# Altium schematic sheet SH16 - SPI ROM.SchDoc
size 386 x 246 mm
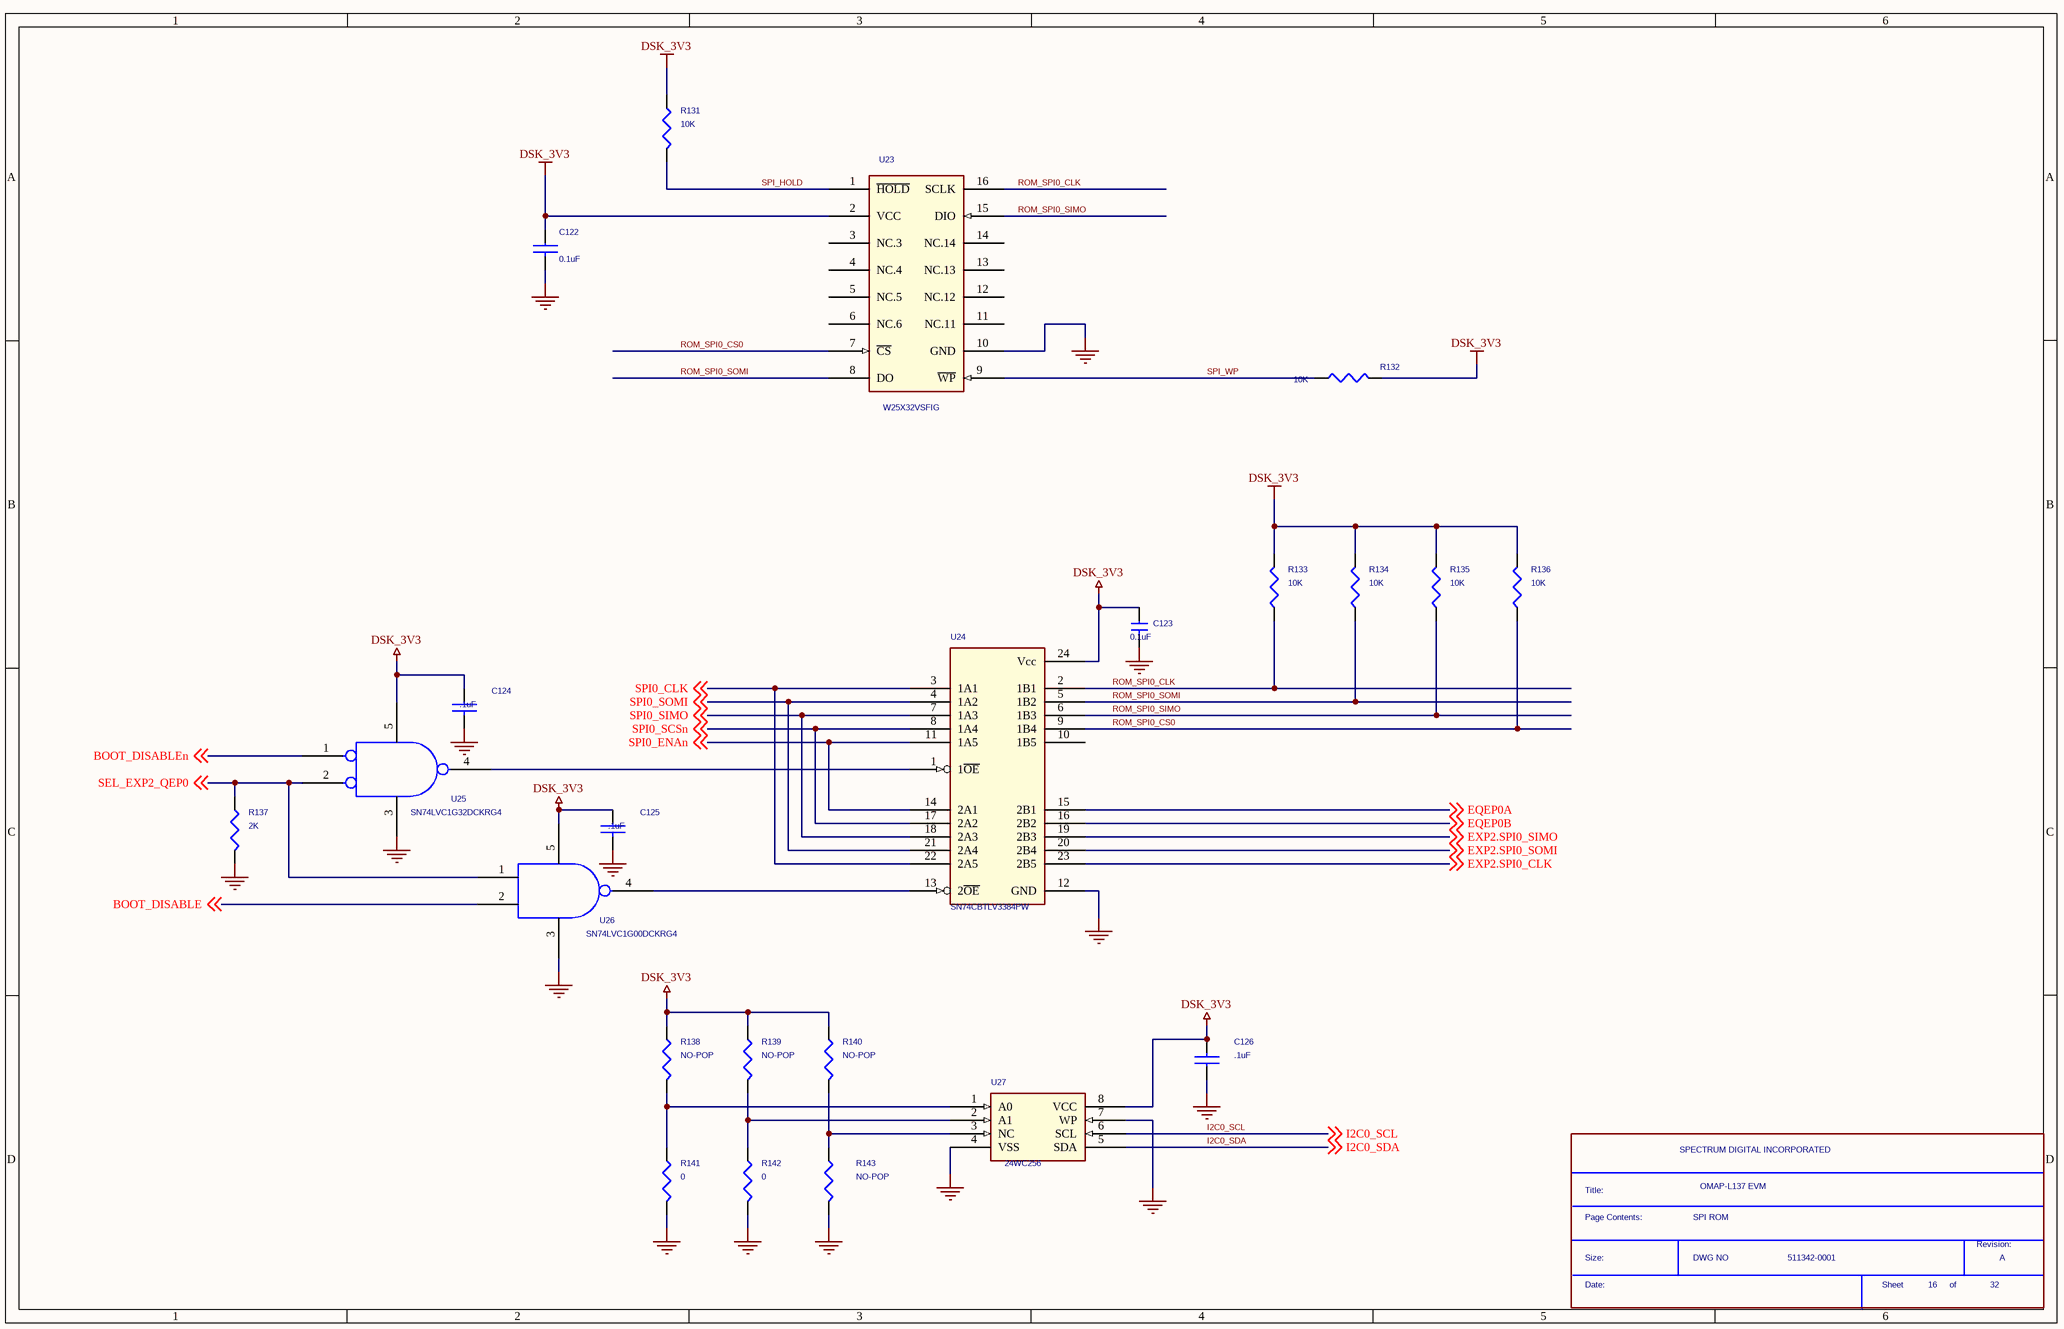
[diagram p0: SH16 - SPI ROM.SchDoc]

## Parts
*  Page Contents:: SPI ROM  RevCode: A  Title: OMAP-L137 EVM  OrgName: SPECTRUM DIGITAL INCORPORATED  Doc: 511342-0001  Page Number: 16  Page Count: 32  (hidden comment: SDTitleBlock)  (graphical)
C122  0.1uF  [c402-25]
C123  0.1uF  [c402-25]
C124  .1uF  [c402-25]
C125  .1uF  [c402-25]
C126  .1uF  [C0603]
R131  10K  [r402-25]
R132  10K  [r402-25]
R133  10K  [r402-25]
R134  10K  [r402-25]
R135  10K  [r402-25]
R136  10K  [r402-25]
R137  2K  [r402-25]
R138  NO-POP  [r402-25]
R139  NO-POP  [r402-25]
R140  NO-POP  [r402-25]
R141  0  [r402-25]
R142  0  [r402-25]
R143  NO-POP  [r402-25]
U23  W25X32VSFIG  [so16-25x75-300]
U24  SN74CBTLV3384PW  [TSSOP-24]
U25  SN74LVC1G32DCKRG4  [dck-5]
U26  SN74LVC1G00DCKRG4  [dck-5]
U27  24WC256  [SOIC]

## Nets
DSK_3V3: C122.1 C123.1 C124.1 C125.1 C126.2 R131.1 R132.1 R133.2 R134.2 R135.2 R136.2 R138.1 R139.1 R140.1 U23.2(VCC) U24.24(Vcc) U25.5(VCC) U26.5(VCC) U27.8(VCC)
GND: C122.2 C123.2 C124.2 C125.2 C126.1 R137.2 R141.2 R142.2 R143.2 U23.10(GND) U24.12(GND) U25.3(GND) U26.3(GND) U27.4(VSS) U27.7(WP)
BOOT_DISABLE: U26.2(B) ; off-sheet BOOT_DISABLE
BOOT_DISABLEn: U25.1(A) ; off-sheet BOOT_DISABLEn
EQEP0A: U24.15(2B1) ; off-sheet EQEP0A
EQEP0B: U24.16(2B2) ; off-sheet EQEP0B
EXP2.SPI0_CLK: U24.23(2B5) ; off-sheet EXP2.SPI0_CLK
EXP2.SPI0_SIMO: U24.19(2B3) ; off-sheet EXP2.SPI0_SIMO
EXP2.SPI0_SOMI: U24.20(2B4) ; off-sheet EXP2.SPI0_SOMI
I2C0_SCL: U27.6(SCL) ; off-sheet I2C0_SCL
I2C0_SDA: U27.5(SDA) ; off-sheet I2C0_SDA
ROM_SPI0_CLK: R133.1 U23.16(SCLK) U24.2(1B1)
ROM_SPI0_CS0: R136.1 U23.7(~{CS}) U24.9(1B4)
ROM_SPI0_SIMO: R135.1 U23.15(DIO) U24.6(1B3)
ROM_SPI0_SOMI: R134.1 U23.8(DO) U24.5(1B2)
SEL_EXP2_QEP0: R137.1 U25.2(B) U26.1(A) ; off-sheet SEL_EXP2_QEP0
SPI0_CLK: U24.3(1A1) U24.22(2A5) ; off-sheet SPI0_CLK
SPI0_ENAn: U24.11(1A5) U24.14(2A1) ; off-sheet SPI0_ENAn
SPI0_SCSn: U24.8(1A4) U24.17(2A2) ; off-sheet SPI0_SCSn
SPI0_SIMO: U24.7(1A3) U24.18(2A3) ; off-sheet SPI0_SIMO
SPI0_SOMI: U24.4(1A2) U24.21(2A4) ; off-sheet SPI0_SOMI
SPI_HOLD: R131.2 U23.1(~{HOLD})
SPI_WP: R132.2 U23.9(~{WP})
NetR138_2: R138.2 R141.1 U27.1(A0)
NetR139_2: R139.2 R142.1 U27.2(A1)
NetR140_2: R140.2 R143.1 U27.3(NC)
NetU24_1: U24.1(1~{OE}) U25.4(Y)
NetU24_13: U24.13(2~{OE}) U26.4(Y)

Not connected (* = marked no-connect by the designer): U23 3(NC.3) 4(NC.4) 5(NC.5) 6(NC.6) 11(NC.11) 12(NC.12) 13(NC.13) 14(NC.14); U24 10(1B5)

## Notes on the sheet
- (in symbol SDTitleBlock) Title:; Page Contents:; Revision:; Size:; DWG NO; Date:; Sheet; of

## Library data of the parts
C122 = CAP NP: Part #: 101587-1100R
C123 = CAP NP_1: Part #: 101587-1100R
C124 C125 = CAP NP_2: Part #: 101587-1100R
C126 = CAP .1 uF 10% 0603: Part #: 101587-1100R; SD PCB Footprint: EIA0603
R131 = R: Part #: 101370-1003R
R132-R136 = RESISTOR_1: Part #: 101370-1003R
R137 = R: Part #: 101370-2002R
R138-R140 R143 = R: Part #: R0402-NOPOP
R141 R142 = R_1: Part #: 101370-0001R; SD PCB Footprint: EIA0603
U23 = SPI_EEPROM_0: Part #: 102801-0001R
U24 = SN74CBTD3384PW: IC, Quad 2-to-1 Mux with Level Conversion; Part #: 101679-0001R; Mfg: TI
U25 = 1g32neg: Part #: 101057-0032R
U26 = 1g00_0: Part #: 101057-0001R
U27 = 24WC256: 256K-Bit I 2 C Serial CMOS EEPROM; Part #: 102235-0001R; SD PCB Footprint: SO8W